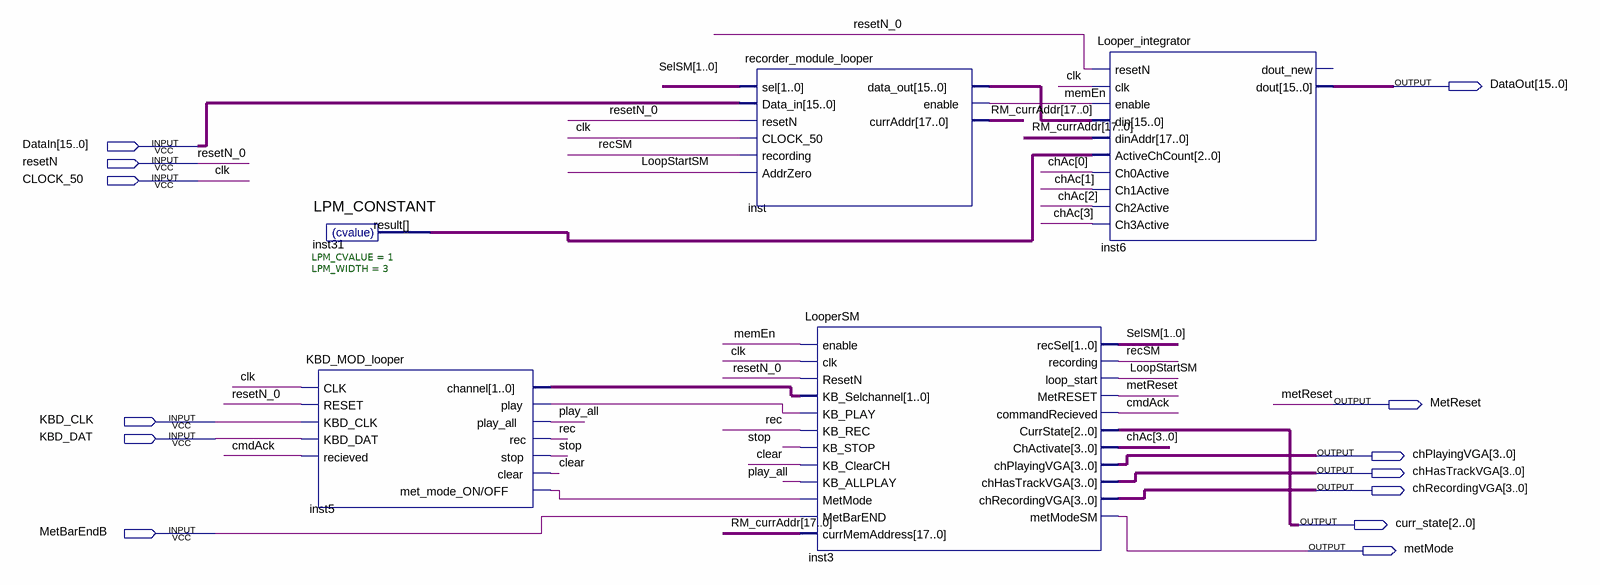
[diagram p0: schematic sheet]
// Quartus schematic LooperMemController.bdf as structural Verilog: 5 symbols, 13 pins
module LooperMemController (
  input  [15:0] DataIn,
  input  resetN,
  input  CLOCK_50,
  input  KBD_CLK,
  input  KBD_DAT,
  input  MetBarEndB,
  output [15:0] DataOut,
  output MetReset,
  output [3:0] chPlayingVGA,
  output [3:0] chHasTrackVGA,
  output [3:0] chRecordingVGA,
  output [2:0] curr_state,
  output metMode
);

  wire clear, cmdAck, inst5_met_mode_on_off, inst5_play, LoopStartSM, memEn, play_all, rec, recSM, stop;
  wire [1:0] inst5_channel, SelSM;
  wire [2:0] inst31_result;
  wire [3:0] chAc;
  wire [15:0] inst_data_out;
  wire [17:0] RM_currAddr;

  KBD_MOD_looper inst5 (
    .CLK(CLOCK_50), .RESET(resetN), .KBD_CLK(KBD_CLK), .KBD_DAT(KBD_DAT), .recieved(cmdAck),
    .channel(inst5_channel), .play(inst5_play), .play_all(play_all), .rec(rec), .stop(stop), .clear(clear),
    .\met_mode_ON/OFF (inst5_met_mode_on_off));
  LPM_CONSTANT #(.LPM_CVALUE(1), .LPM_WIDTH(3)) inst31 (.result(inst31_result));
  recorder_module_looper inst (
    .sel(SelSM), .Data_in(DataIn), .resetN(resetN), .CLOCK_50(CLOCK_50), .recording(recSM),
    .AddrZero(LoopStartSM), .data_out(inst_data_out), .enable(memEn), .currAddr(RM_currAddr));
  LooperSM inst3 (
    .enable(memEn), .clk(CLOCK_50), .ResetN(resetN), .KB_Selchannel(inst5_channel), .KB_PLAY(inst5_play),
    .KB_REC(rec), .KB_STOP(stop), .KB_ClearCH(clear), .KB_ALLPLAY(play_all), .MetMode(inst5_met_mode_on_off),
    .MetBarEND(MetBarEndB), .currMemAddress(RM_currAddr), .recSel(SelSM), .recording(recSM),
    .loop_start(LoopStartSM), .MetRESET(MetReset), .commandRecieved(cmdAck), .CurrState(curr_state),
    .ChActivate(chAc), .chPlayingVGA(chPlayingVGA), .chHasTrackVGA(chHasTrackVGA),
    .chRecordingVGA(chRecordingVGA), .metModeSM(metMode));
  Looper_integrator inst6 (
    .resetN(resetN), .clk(CLOCK_50), .enable(memEn), .din(inst_data_out), .dinAddr(RM_currAddr),
    .ActiveChCount(inst31_result), .Ch0Active(chAc[0]), .Ch1Active(chAc[1]), .Ch2Active(chAc[2]),
    .Ch3Active(chAc[3]), .dout(DataOut));  // open: dout_new

  // Other names for the same wires on the sheet: clk = CLOCK_50; resetN_0 = resetN
endmodule
